# Altium schematic sheet MIDI.SchDoc: Audio_Moduloop - MIDI
size A; Date: 2/27/2024; DrawnBy: Team 28: Ryan Gordon, Conor Curtin, Evan Roveili, Shawn Colby; DocumentNumber: 2; Revision: V1; SheetNumber: 2; SheetTotal: 7
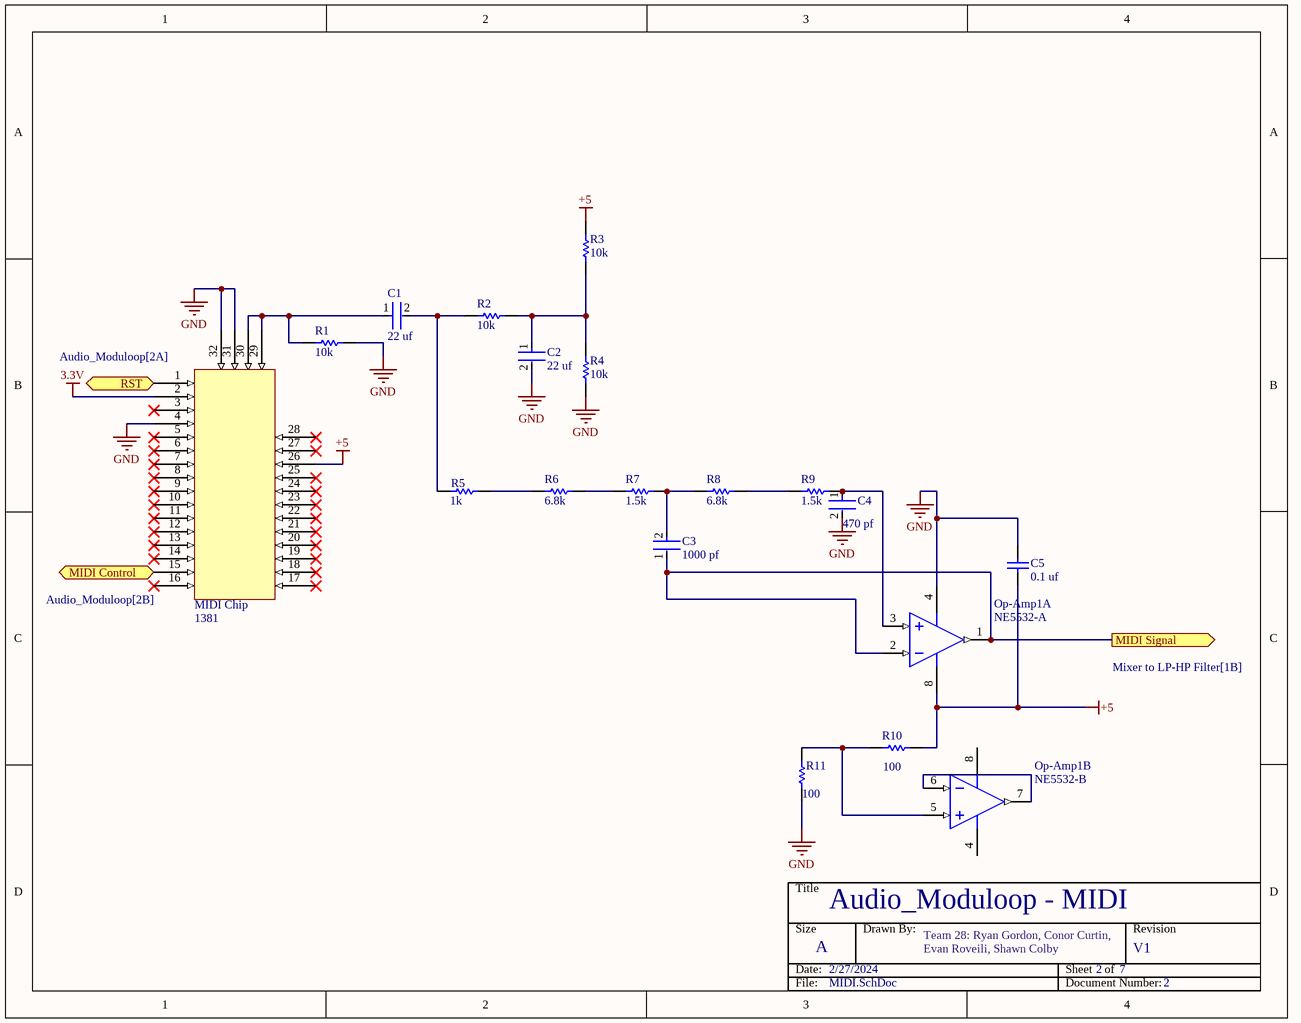
[diagram p0: MIDI.SchDoc]

## Parts
C1  22 uf  [FP-RCEWM1-MFG]
C2  22 uf  [FP-RCEWM1-MFG]
C3  1000 pf  [FP-VY1102M35Y5UQ6TV0-MFG]
C4  470 pf  [FP-F471K33Y5RP6UK5R-MFG]
C5  0.1 uf  [AVX-SA115C104KAR]
MIDI_Chip  1381  [FEATHERWING]
Op-Amp1  NE5532-A  [ONSC-SOIC-8-751-07_V]  (parts A,B of 2)
R1  10k  [RESC2013X60X35NL10T20]
R2  10k  [RESC2013X60X35NL10T20]
R3  10k  [RESC2013X60X35NL10T20]
R4  10k  [RESC2013X60X35NL10T20]
R5  1k  [RESC2013X70X40ML20T20]
R6  6.8k  [RESC2013X70X40LL20T20]
R7  1.5k  [RESC2013X60X40LL20T25]
R8  6.8k  [RESC2013X70X40LL20T20]
R9  1.5k  [RESC2013X60X40LL20T25]
R10  100  [RESC2013X60X40ML20T25]
R11  100  [RESC2013X60X40ML20T25]

## Ports
MIDI Control (bidir, see Audio_Moduloop[2B]), MIDI Signal (out, see Mixer to LP-HP Filter[1B]), RST (bidir, see Audio_Moduloop[2A])

## Nets
3.3V: MIDI_Chip.2
+5: C5.1 MIDI_Chip.26 Op-Amp1.8(V+) R3.1 R10.2
GND: C2.2 C4.2 C5.2 MIDI_Chip.4 MIDI_Chip.31 MIDI_Chip.32 Op-Amp1.4(V-) R1.2 R4.2 R11.1
MIDI Control: MIDI_Chip.15 ; port MIDI Control
MIDI Signal: C3.1 Op-Amp1.1(OUTA) Op-Amp1.2(INA-) ; port MIDI Signal
RST: MIDI_Chip.1 ; port RST
NetC1_1: C1.1 MIDI_Chip.29 MIDI_Chip.30 R1.1
NetC1_2: C1.2 R2.1 R5.1
NetC2_1: C2.1 R2.2 R3.2 R4.1
NetC3_2: C3.2 R7.2 R8.1
NetC4_1: C4.1 Op-Amp1.3(INA+) R9.2
NetOp-Amp1_5: Op-Amp1.5(INB+) R10.1 R11.2
NetOp-Amp1_6: Op-Amp1.6(INB-) Op-Amp1.7(OUTB)
NetR5_2: R5.2 R6.1
NetR6_2: R6.2 R7.1
NetR8_2: R8.2 R9.1

Not connected (* = marked no-connect by the designer): MIDI_Chip 3* 5* 6* 7* 8* 9* 10* 11* 12* 13* 14* 16* 17* 18* 19* 20* 21* 22* 23* 24* 25* 27* 28*

## Notes on the sheet
- Title
- Size
- Date:
- A
- Drawn By:
- Sheet    of
- Revision
- File:
- Document Number:

## Library data of the parts
C1 C2 = CMP-06035-003622-1: CAP CER 22UF 25V X7R RADIAL; Tolerance: 20%; Lead Diameter: 0.5mm; Lead/Base Style: Formed Leads; Height - Seated (Max): 0.295inch; Height: 7.5mm; Capacitance: 22uF; Max Operating Temperature: 125°C; Package Quantity: 1500; Case/Package: Radial; Length: 0.217inch; Lead Pitch: 0.197inch; Voltage Rating (DC): 25V; Ratings: AEC-Q200; Mount: Through Hole; Packaging: Tape and Reel; Voltage Rating: 25V; Min Operating Temperature: -55°C; Width: 0.157inch; Resistor Type: Ceramic; Termination: Radial; Dielectric: X7R
C3 = CMP-02417-000063-1: CAP CER 1000PF 760VAC Y5U RADIAL; Voltage: 500V; Capacitance: 1nF; Lead Diameter: 0.6mm; Lead/Base Style: Kinked; Tolerance: 20%; Construction: RADIAL; Dielectric: Y5U; RoHS Compliant: Yes; Resistor Type: Ceramic; Min Operating Temperature: -40°C; Height - Seated (Max): 0.512inch; Series: VY1; Diameter: 9mm; Voltage Rating (AC): 500V; Termination: Radial; Depth: 5mm; Radiation Hardening: No; Lead Pitch: 10mm; Package Quantity: 500; Case/Package: Radial; Height: 12mm; Contact Plating: Tin; Voltage Rating (DC): 500V; Max Operating Temperature: 125°C; Packaging: Tape and Reel; Mount: Through Hole
C4 = CMP-02417-000080-1: CAP CER 470PF 2KV Y5R RADIAL; Tolerance: 10%; Dielectric Material: Ceramic; Insulation Resistance: 10GR; Lead/Base Style: Kinked; Lead Diameter: 0.8mm; Series: F; Depth: 5mm; Package Quantity: 1500; Resistor Type: Ceramic; Construction: RADIAL; Min Operating Temperature: -30°C; Mount: Through Hole; Radiation Hardening: No; Voltage: 2kV; Voltage Rating: 2kV; Max Operating Temperature: 125°C; Termination: Radial; RoHS Compliant: Yes; Lead Pitch: 5mm; Capacitance: 470pF; Packaging: Tape and Reel; Length: 8.5mm; Case/Package: Radial; Dielectric: Y5R
C5 = CMP-2000-07029-1: Axial Leads / SpinGuard(R), Ceramic Capacitor, 0.10 uF +/- 10%, 50V, -55 to 125 degC, 2-Pin THD, RoHS, Tape and Reel; Manufacturer: AVX; Other Names: 478-3151-1; Catalog Drawings: SASeries_4.32x3.05; Capacitance: 0.1µF; Temperature Coefficient: X7R; Online Catalog: SpinGuard®SASeries; Product Training Modules: ComponentSolutionsforSmartMeterApplications; Category: Capacitors; Package Description: 2-Pin Axial Lead, Dia 3.05 mm, Body Length 4.32 mm; Standard Package: 1; Mounting Technology: ThroughHole; Ratings: -; Datasheet Version: 06/2007; Voltage - Rated: 50V; Tolerance: ±10%; Package Reference: SA115C104KAR; Packaging: -; Lead Style: -; Size / Dimension: 0.120"Diax0.170"L(3.05mmx4.32mm); Mounting Type: ThroughHole; Operating Temperature: -55°C~125°C; Datasheet URL: https://datasheet.ciiva.com/27051/1074183-27051369.pdf; Applications: GeneralPurpose; Thickness (Max): -; Lead Spacing: -; Height - Seated (Max): -; Family: CeramicCapacitors; Package / Case: Axial; Features: -; Series: SpinGuard®SA; Manufacturer URL: http://www.avx.com/
MIDI_Chip = CMP-00030-00003-3: Conn, Rect, PowerPoleHousing, PP180Series, Blue, 180A, 600V; Pins: 32
Op-Amp1 = CMP-1310-00252-1: Internally Compensated Dual Low Noise Operational Amplifier, 6 to 40 V, 0 to 70 degC, 8-Pin SOIC, Pb-Free, Tape and Reel; Manufacturer: On Semiconductor; PartNumber: NE5532AD8R2G; SR Typ (V/uS): 9; VCC Min (V): 6; VCC Max (V): 40; GBW Typ (MHz): 10; PackageVersion: Rev. AK, 02/2011; ComponentLink2URL: http://www.onsemi.cn/pub_link/Collateral/NE5532-D.PDF; RoHS: TRUE; PackageReference: SOIC-8-751-07; ComponentLink2Description: Datasheet; PackageDescription: 8-Pin Small Outline Integrated Circuit, Body 4.9 x 3.9 mm, Pitch 1.27 mm; ComponentLink3URL: http://www.onsemi.com/pub_link/Collateral/751-07.PDF; ComponentLink1Description: Manufacturer URL; DatasheetVersion: Rev. 2; Packing: Tape and Reel; ComponentLink1URL: http://www.onsemi.com/; ComponentLink3Description: Package Specification; Mounting Technology: Surface Mount
R1-R4 = CMP-1659-00013-4: Chip Resistor, 10 KOhm, +/- 1%, 0.125 W, -55 to 155 degC, 0805 (2012 Metric), RoHS, Tape and Reel; Manufacturer: Yageo; Voltage Rating: 150 V; Mount: Surface Mount; ComponentLink1Description: Manufacturer URL; ComponentLink2URL: http://www.yageo.com/documents/recent/PYu-RC_Group_51_RoHS_L_04.pdf; Pins: 2; Length: 2 mm; Min Operating Temperature: -55 degC; Height: 0.5 mm; Mounting Technology: Surface Mount; RoHSCompliant: true; REACH SVHC: No SVHC; ComponentLink1URL: http://www.yageo.com/; Max Operating Temperature: 155 degC; PackageReference: 0805; DatasheetVersion: Rev. 4, 02/2016; Package Quantity: 5000; Packaging: Tape and Reel; ComponentLink2Description: Datasheet; PackageDescription: 2-Pin Surface Mounted Device, Body 2 x 1.25 mm
R5 = CMP-2001-04375-5: Chip Resistor, 1 KOhm, +/- 1%, 0.125 W, -55 to 155 degC, 0805 (2012 Metric), RoHS, Tape and Reel; Manufacturer: Panasonic; Voltage Rating: 150 V; ComponentLink1URL: http://www.panasonic.com/; ComponentLink2Description: Datasheet; REACH SVHC: Yes; ComponentLink1Description: Manufacturer URL; Length: 2 mm; Height: 0.6 mm; Package Quantity: 1; PackageDescription: 2-Pin Surface Mount Device, Body 2 x 1.25 mm; Packaging: Cut Tape; PackageReference: 0805; Max Operating Temperature: 155 degC; Mounting Technology: Surface Mount; ComponentLink2URL: http://industrial.panasonic.com/cdbs/www-data/pdf/RDA0000/AOA0000C86.pdf; DatasheetVersion: 04/2015; Min Operating Temperature: -55 degC; RoHSCompliant: true; Mount: Surface Mount
R6 R8 = CMP-2001-00567-1: Manufacturer: Panasonic; Part Number: ERJ6ENF6801V
R7 R9 = CMP-2001-00597-1: Manufacturer: Panasonic; Part Number: ERA6AEB152V
R10 R11 = CMP-2001-00580-1: Manufacturer: Panasonic; Part Number: ERA6AEB101V